# EAGLE design Optical_Spark_V2.0 (EAGLE 9.2.2)
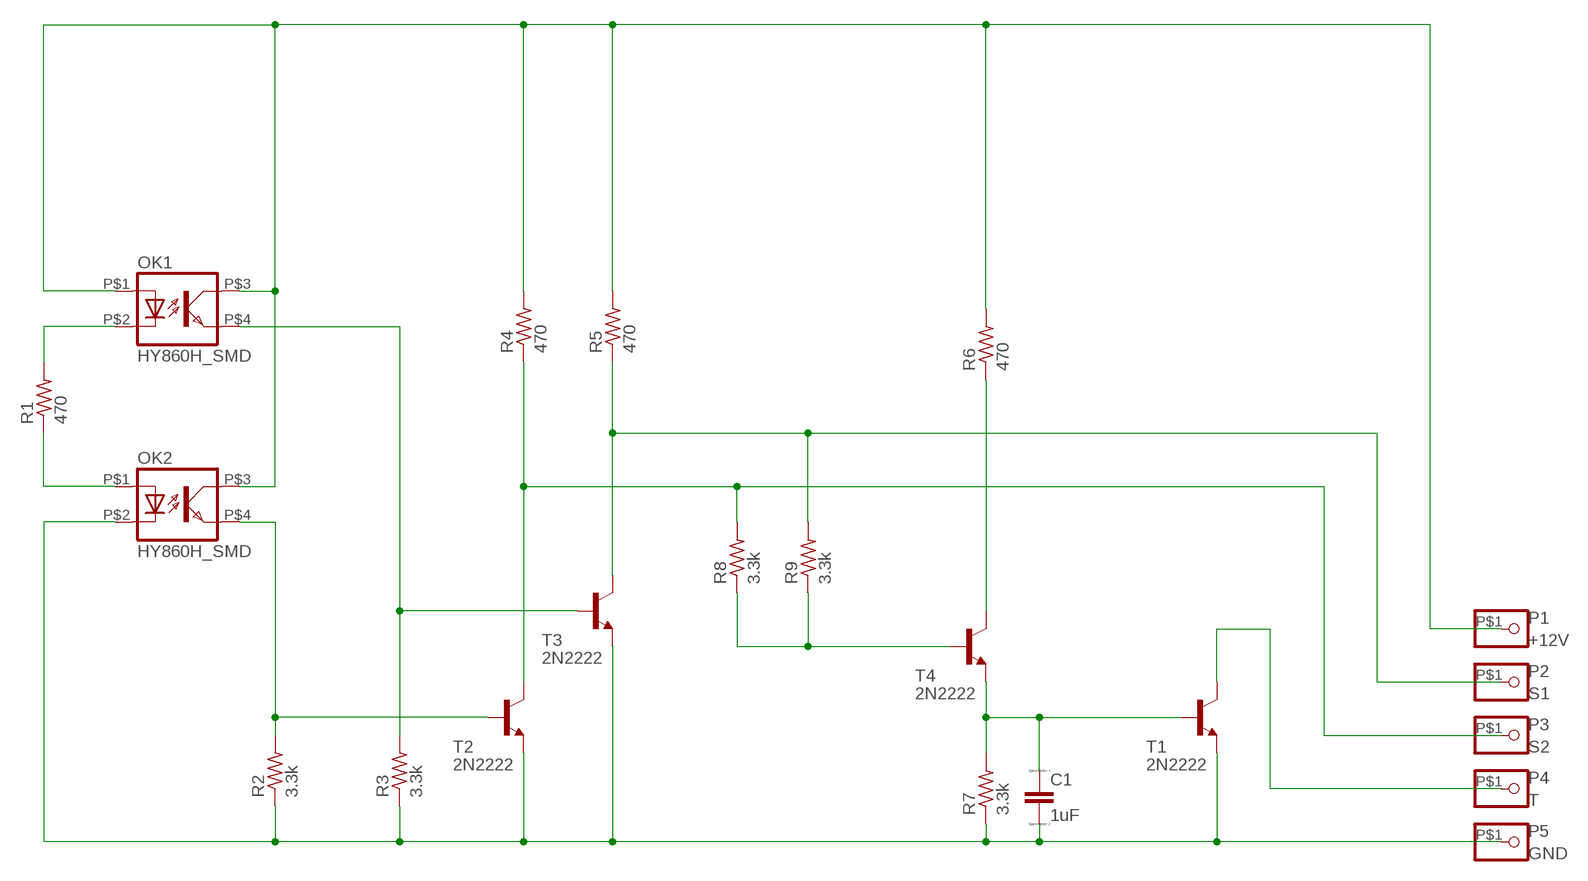
[diagram p0: schematic, sheet 1]

## Parts
C1  1uF  SMALLCAP_THT_SMD  [SMALLCAP_THT_SMD]
OK1  HY860H_SMD  [HY860H_SMD]
OK2  HY860H_SMD  [HY860H_SMD]
P1  +12V  PAD  [PAD]
P2  S1  PAD  [PAD]
P3  S2  PAD  [PAD]
P4  T  PAD  [PAD]
P5  GND  PAD  [PAD]
R1  470  0.25W_THT_SMD  [0.25W_THT_SMD]
R2  3.3k  0.25W_THT_SMD_SMALL  [0.25W_THT_SMD_SMALL]
R3  3.3k  0.25W_THT_SMD_SMALL  [0.25W_THT_SMD_SMALL]
R4  470  0.25W_THT_SMD  [0.25W_THT_SMD]
R5  470  0.25W_THT_SMD  [0.25W_THT_SMD]
R6  470  0.25W_THT_SMD  [0.25W_THT_SMD]
R7  3.3k  0.25W_THT_SMD_SMALL  [0.25W_THT_SMD_SMALL]
R8  3.3k  0.25W_THT_SMD_SMALL  [0.25W_THT_SMD_SMALL]
R9  3.3k  0.25W_THT_SMD_SMALL  [0.25W_THT_SMD_SMALL]
T1  2N2222  NPN_THT_SMD_EBC  [NPN_THT_SMD_EBC]
T2  2N2222  NPN_THT_SMD_EBC  [NPN_THT_SMD_EBC]
T3  2N2222  NPN_THT_SMD_EBC  [NPN_THT_SMD_EBC]
T4  2N2222  NPN_THT_SMD_EBC  [NPN_THT_SMD_EBC]

## Nets
N$1: OK1.P$2(C) R1.P$2
N$2: OK2.P$1(A) R1.P$1
N$3: C1.P$2 OK2.P$2(C) P5.P$1 R2.P$1 R3.P$1 R7.P$1 T1.P$1(E) T2.P$1(E) T3.P$1(E)
N$4: OK1.P$1(A) OK1.P$3(COL) OK2.P$3(COL) P1.P$1 R4.P$2 R5.P$2 R6.P$2
N$5: C1.P$1 R7.P$2 T1.P$2(B) T4.P$1(E)
N$6: OK2.P$4(EMIT) R2.P$2 T2.P$2(B)
N$7: OK1.P$4(EMIT) R3.P$2 T3.P$2(B)
N$8: P2.P$1 R5.P$1 R9.P$2 T3.P$3(C)
N$9: P3.P$1 R4.P$1 R8.P$2 T2.P$3(C)
N$10: R6.P$1 T4.P$3(C)
N$11: P4.P$1 T1.P$3(C)
N$12: R8.P$1 R9.P$1 T4.P$2(B)

## Library data of the parts
C1 = Optical_Spark_Parts:SMALLCAP_THT_SMD
OK1 OK2 = Optical_Spark_Parts:HY860H_SMD
P1-P5 = Optical_Spark_Parts:PAD
R1 R4-R6 = Optical_Spark_Parts:0.25W_THT_SMD
R2 R3 R7-R9 = Optical_Spark_Parts:0.25W_THT_SMD_SMALL
T1-T4 = Optical_Spark_Parts:NPN_THT_SMD_EBC

## Board
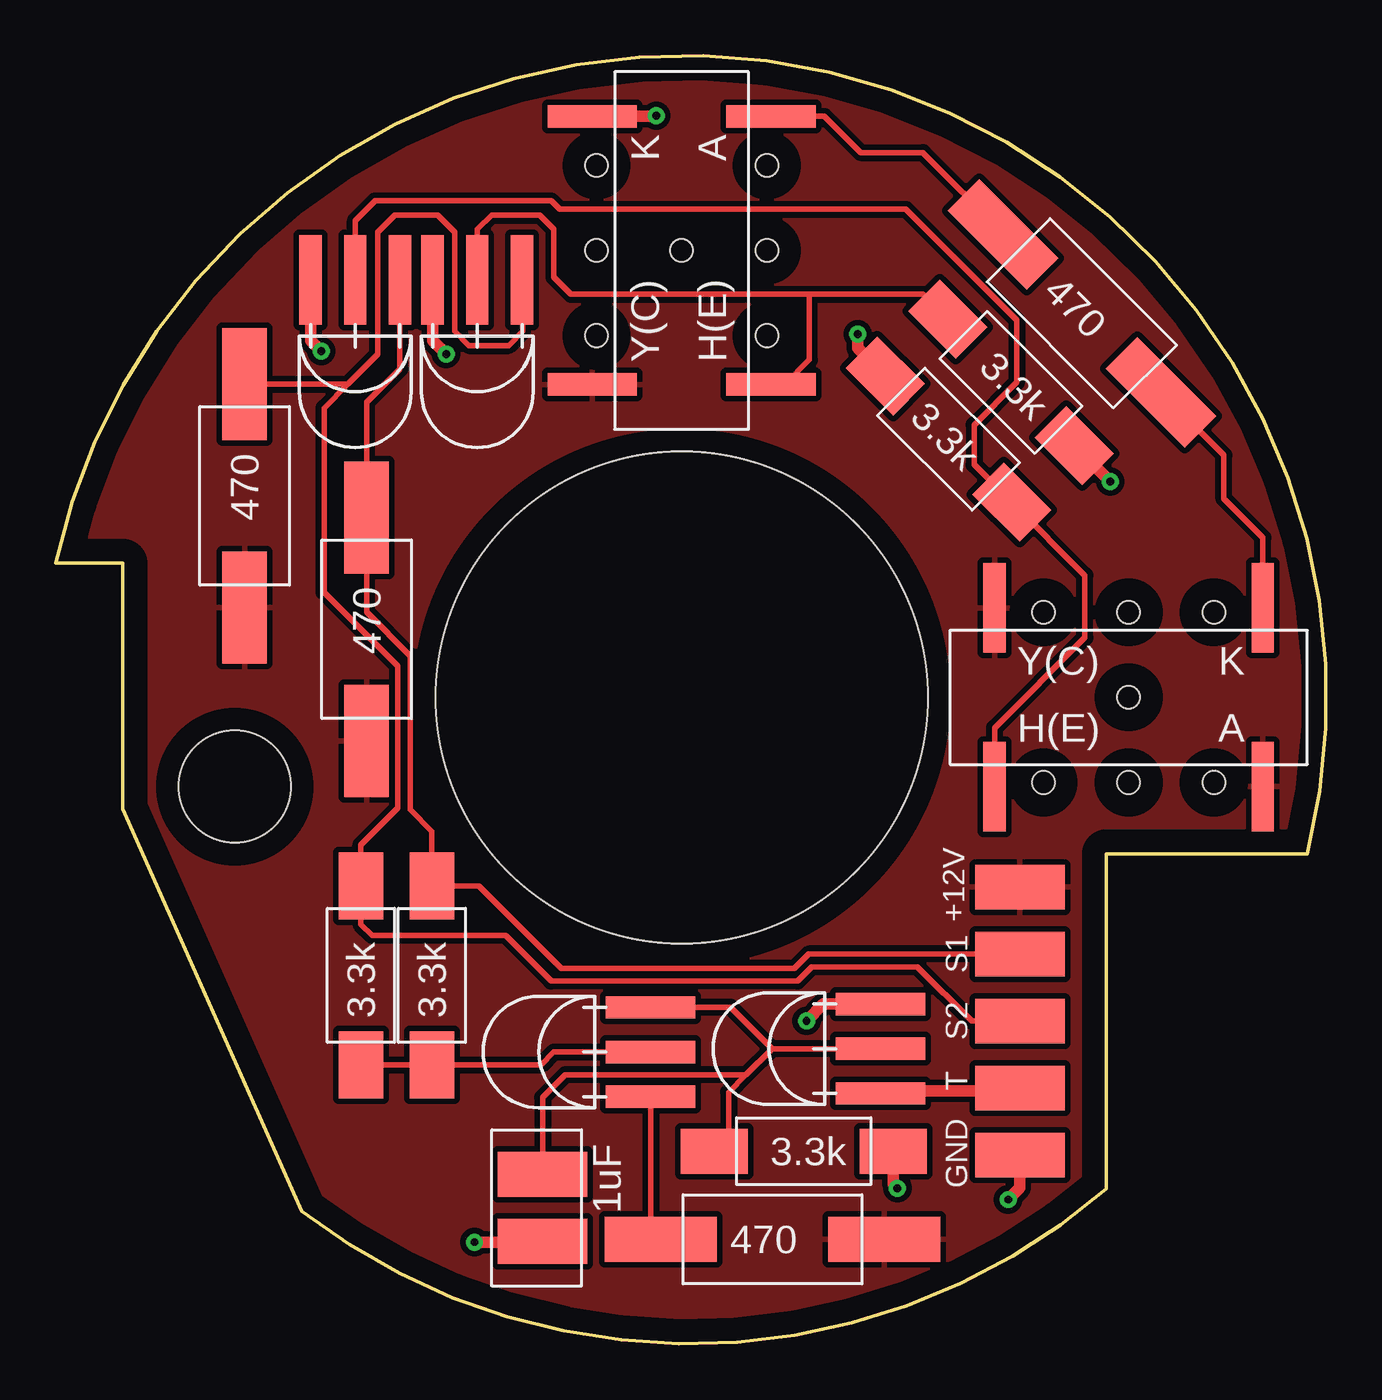
[diagram p1: board, top side]
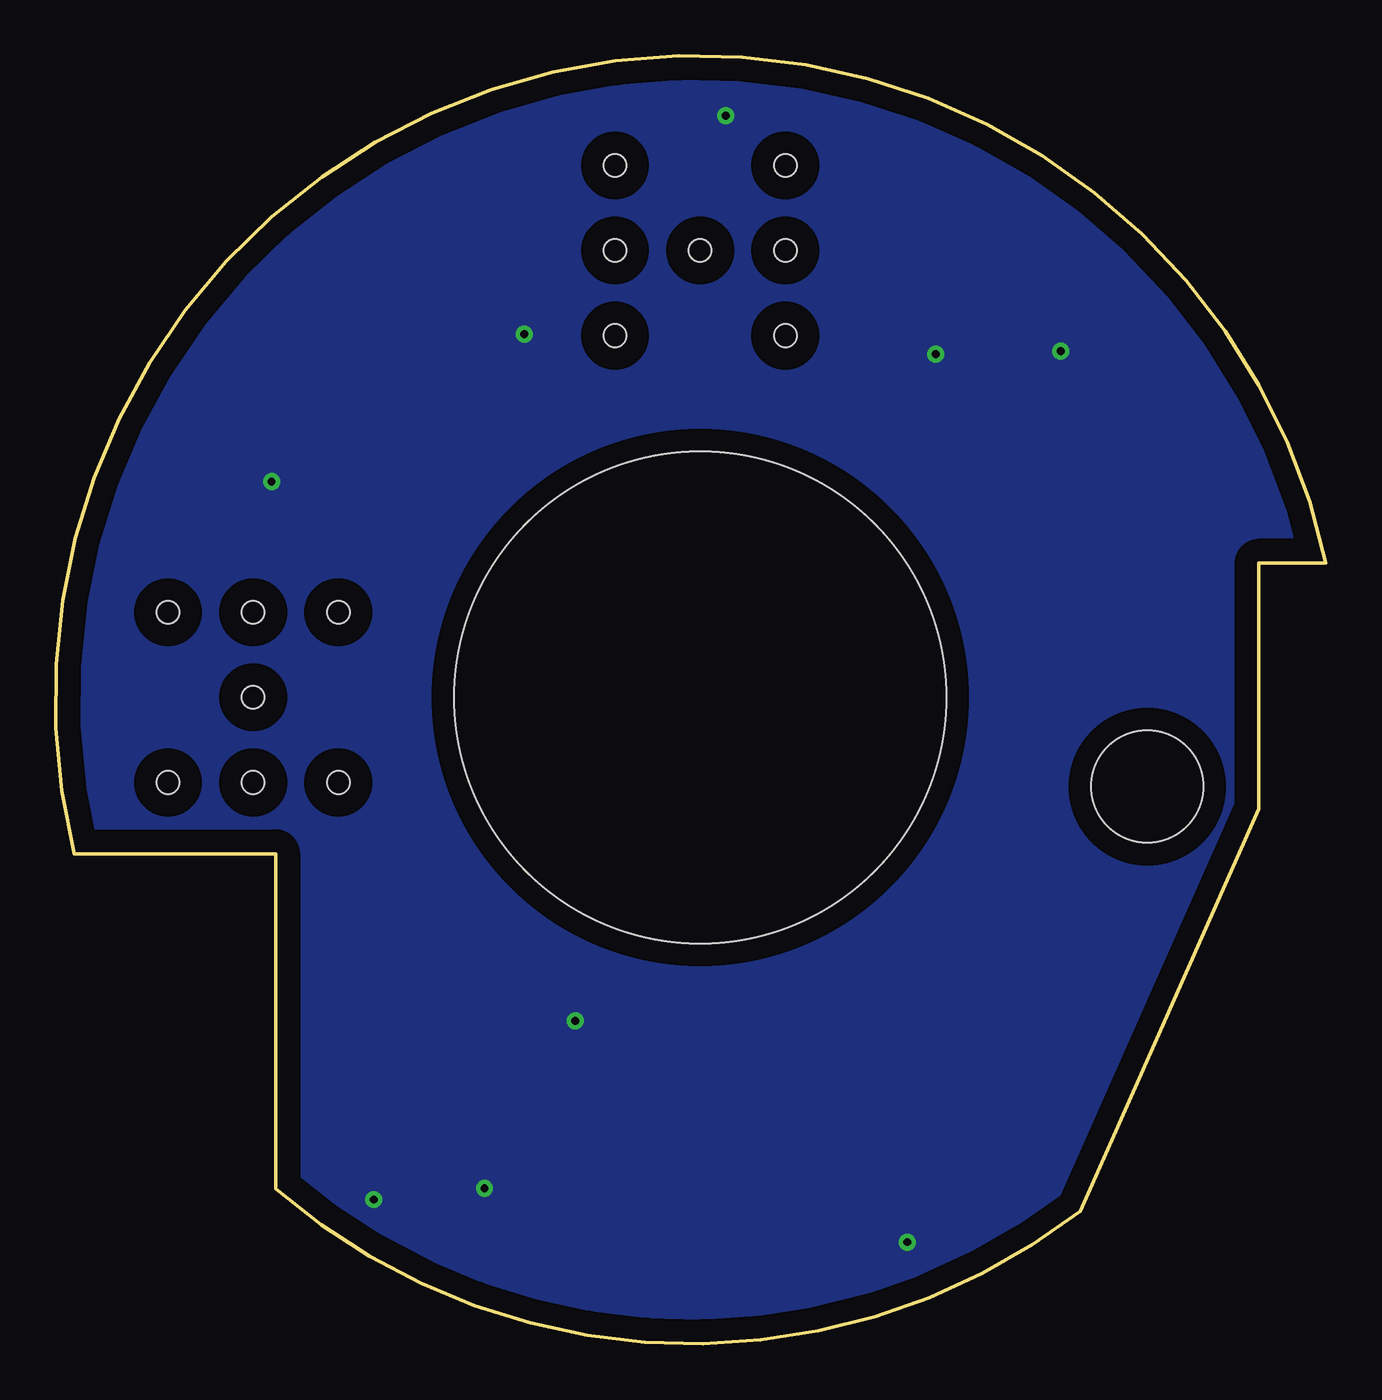
[diagram p2: board, bottom side, seen from below]

Size 56.83 x 57.64 mm. Coordinates in mm from the lower left corner, seen from the top.
Outline: 0,34.93 arc-182 56,21.93 47,21.93 47,6.93 arc-79 11,5.93 3,23.93 3,34.93 0,34.93
Copper layers (1*16): Top 0.035mm / dielectric 1.5mm / Bottom 0.035mm
Design rules "default *": minimum track width 6mil, minimum drill 0.35mm, track to track 10mil, track to pad 10mil, pad to pad 10mil, via to via 10mil, smd to smd 6mil, copper to edge 40mil, drill to drill 6mil, minimum pad ring 10mil, minimum via ring 8mil, stop-mask expansion 4mil, vias tented up to drill 0mil, thermal gap 10mil
Holes 5 mm at 8,24.93
Holes 22 mm at 28,28.93

### Footprints (pad centres in the part's own frame; a part is rotated, then mirrored left to right if it is on the bottom)
SMALLCAP_THT_SMD = smd 2 x 4: P$1 -1,1.27; P$2 2,1.27
HY860H_SMD = smd 1 x 4: P$1 6,-4; P$2 6,4; P$3 -6,4; P$4 -6,-4 | hole 1: -3.81,3.81; 3.81,3.81; 0,3.81; -3.81,-3.81; 0,-3.81; 3.81,-3.81; 0,0
PAD = smd 4 x 2: P$1 0,0
0.25W_THT_SMD = smd 5 x 2: P$1 -5,0; P$2 5,0
0.25W_THT_SMD_SMALL = smd 3 x 2: P$1 -4,0; P$2 4,0
NPN_THT_SMD_EBC = smd 4 x 1: P$1 0.5,-2; P$2 0.5,0; P$3 0.5,2

### Placement (x,y rotation side)
C1  20.51,6.58 270 top
OK1  48,28.93 0 top
OK2  28,48.93 90 top
P1  43.13,20.44 0 top
P2  43.13,17.44 0 top
P3  43.13,14.44 0 top
P4  43.13,11.44 0 top
P5  43.13,8.44 0 top
R1  45.9,46.12 315 top
R2  42.73,43.03 135 top
R3  39.94,40.49 315 top
R4  8.44,37.95 270 top
R5  13.9,31.98 270 top
R6  32.06,4.67 0 top
R7  33.46,8.61 180 top
R8  13.65,16.48 90 top
R9  16.82,16.48 90 top
T1  37.4,13.2 180 top
T2  18.86,48.11 270 top
T3  13.39,48.11 270 top
T4  27.11,13.05 180 top

### Tracks (layer width: path | path; a pad name or v marks a point on that pad's centre or on a via)
N$1
  Top 0.254: OK1.P$2 54,36.08 52.26,37.82 52.26,39.76 R1.P$2
N$2
  Top 0.254: OK2.P$1 34.38,54.93 36,53.31 38.8,53.31 42.37,49.74 R1.P$1
N$3  (via drill 0.35)
  Top 0.508: P5.P$1 43.13,6.98 v42.61,6.45 | R7.P$1 37.46,7.15 v37.65,6.96 | C1.P$2 21.75,4.54 v18.73,4.54 | T2.P$1 16.86,44.9 v17.46,44.3 | T3.P$1 11.39,44.9 v11.87,44.42 | OK2.P$2 26.82,54.93 v26.86,54.96 | R3.P$1 35.87,44.55 v35.87,45.18 | R2.P$1 | v47.18,38.58 R2.P$1 | T1.P$1 34.34,15.2 v33.59,14.45
  pour Bottom: -2,56.93 -2,-1.07 52,-1.07 58,-1.07 58,48.93 58,58.93 -2,58.93
N$4
  Top 0.254: 43.13,20.55 P1.P$1 43.31,20.61 | 42.73,20.29 42.88,20.44 | 54,24.45 OK1.P$1 | 24.95,42.9 24.92,42.93 OK2.P$3
  pour Top: -1.97,59.03 57.97,59.03 57.97,-0.92 -1.97,-0.92
N$5
  Top 0.254: T1.P$2 32.04,13.2 | T4.P$1 30.19,15.05 32.04,13.2 | R7.P$2 30.1,9.24 30.1,11.26 30.88,12.04 | 32.04,13.2 30.88,12.04 | C1.P$1 21.78,11.02 22.79,12.04 30.88,12.04
N$6
  Top 0.254: T2.P$2 18.86,49.88 19.49,50.52 21.65,50.52 22.29,49.88 22.29,47.72 23.05,46.96 33.72,46.96 | R2.P$2 38.8,46.96 33.72,46.96 | OK2.P$4 32.6,42.93 33.72,44.04 33.72,46.96
N$7
  Top 0.254: OK1.P$4 42,27.56 46.03,31.6 46.03,34.39 R3.P$2 41.08,39.34 41.08,41.12 42.99,43.03 42.99,45.82 38.03,50.77 22.54,50.77 22.16,51.15 14.28,51.15 13.39,50.26 T3.P$2
N$8
  Top 0.254: P2.P$1 33.68,17.44 33.03,16.79 22.62,16.79 18.92,20.48 R9.P$2 16.82,22.93 15.86,23.9 15.86,30.78 13.9,32.74 R5.P$1 13.9,42.14 15.39,43.63 T3.P$3
N$9
  Top 0.254: 41.83,14.44 P3.P$1 40.97,14.44 38.54,16.86 33.83,16.86 33.19,16.23 22.16,16.23 20.13,18.26 14.16,18.26 13.65,18.77 R8.P$2 13.65,22.32 15.3,23.98 15.3,30.33 12,33.63 12,41.88 13.06,42.95 | T2.P$3 20.89,47.57 20.89,45.31 20.25,44.68 18.48,44.68 17.84,45.31 17.84,49.76 17.08,50.52 15.17,50.52 14.41,49.76 14.41,44.3 13.06,42.95 | R4.P$1 13.06,42.95
N$10
  Top 0.254: T4.P$3 26.61,5.12 R6.P$1
N$11
  Top 0.508: P4.P$1 43.01,11.31 37.01,11.31 T1.P$3
N$12
  Top 0.254: R8.P$1 R9.P$1 21.71,12.48 22.29,13.05 T4.P$2

### Text on the board
tPlace: +12V | S1 | S2 | T | GND